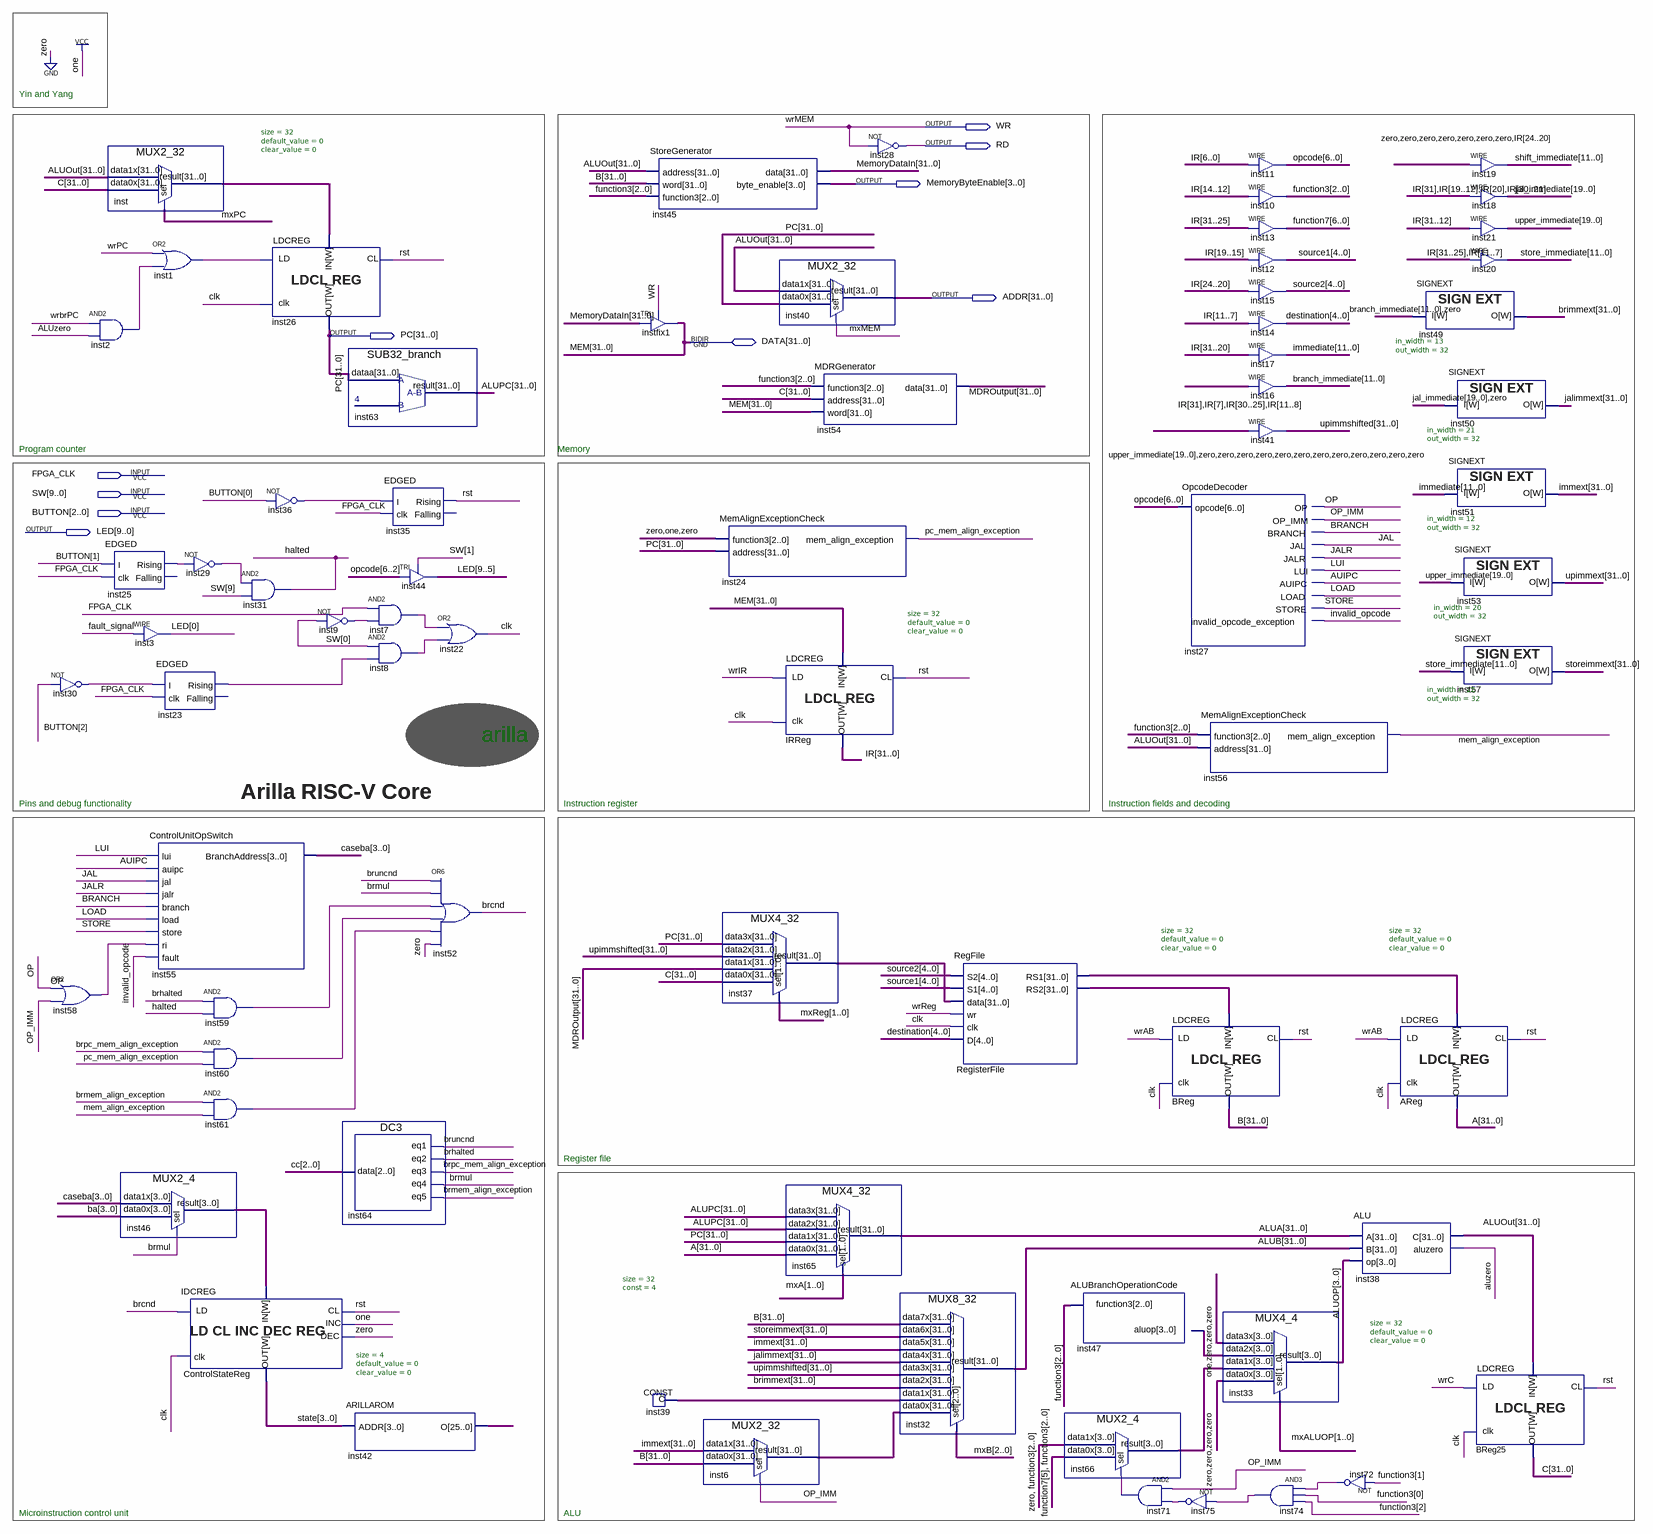
[diagram p0: schematic sheet]
// Quartus schematic ArillaCore.bdf as structural Verilog: 72 symbols, 10 pins
module ArillaCore (
  input  FPGA_CLK,
  input  [9:0] SW,
  input  [2:0] BUTTON,
  inout  [31:0] DATA,
  output WR,
  output RD,
  output [3:0] MemoryByteEnable,
  output [31:0] ADDR,
  output [31:0] PC,
  output [9:0] LED
);

  wire ALUzero, AUIPC, BRANCH, brcnd, brhalted, brmem_align_exception, brmul, brpc_mem_align_exception,
       bruncnd, clk, fault_signal, halted, inst1_out, inst2_out, inst7_out, inst8_out, inst9_out,
       inst23_rising, inst25_rising, inst29_out, inst30_out, inst36_out, inst58_out, inst59_out, inst60_out,
       inst61_out, inst71_out, inst72_out, inst74_out, inst75_out, invalid_opcode, JAL, JALR, LOAD, LUI,
       mem_align_exception, mxMEM, mxPC, OP, OP_IMM, pc_mem_align_exception, rst, STORE, wrAB, wrbrPC, wrC,
       wrIR, wrPC, wrReg;
  wire [1:0] mxA, mxALUOP, mxReg;
  wire [2:0] cc, function3, mxB;
  wire [3:0] ALUOP, ba, caseba, inst46_result, inst47_aluop, inst66_result, state;
  wire [4:0] destination, source1, source2;
  wire [6:0] function7, opcode;
  wire [11:0] branch_immediate, immediate, shift_immediate, store_immediate;
  wire [19:0] jal_immediate, upper_immediate;
  wire [31:0] A, ALUA, ALUB, ALUOut, ALUPC, B, brimmext, C, immext, inst6_result, inst37_result, inst39_data,
       inst_result, IR, jalimmext, MDROutput, MemoryDataIn, RegisterFile_rs1, RegisterFile_rs2, storeimmext,
       upimmext, upimmshifted;

  and inst2 (inst2_out, wrbrPC, ALUzero);
  not inst30 (inst30_out, BUTTON[2]);
  or inst58 (inst58_out, OP, OP_IMM);
  MUX2_32 inst (.data1x(ALUOut), .data0x(C), .sel(mxPC), .result(inst_result));
  EDGED inst25 (.I(BUTTON[1]), .clk(FPGA_CLK), .Rising(inst25_rising));  // open: Falling
  assign LED[0] = fault_signal;  // WIRE inst3
  ControlUnitOpSwitch inst55 (
    .lui(LUI), .auipc(AUIPC), .jal(JAL), .jalr(JALR), .branch(BRANCH), .load(LOAD), .store(STORE),
    .ri(inst58_out), .fault(invalid_opcode), .BranchAddress(caseba));
  MUX2_4 inst46 (.data1x(caseba), .data0x(ba), .sel(brmul), .result(inst46_result));
  or inst1 (inst1_out, wrPC, inst2_out);
  not inst29 (inst29_out, inst25_rising);
  EDGED inst23 (.I(inst30_out), .clk(FPGA_CLK), .Rising(inst23_rising));  // open: Falling
  IDCREG #(.size(4), .default_value(0), .clear_value(0)) ControlStateReg (
    .clk(clk), .data_in(inst46_result), .cl(rst), .inc(1'b1), .dec(1'b0), .ld(brcnd), .data_out(state));
  and inst31 (halted, inst29_out, SW[9]);
  and inst59 (inst59_out, brhalted, halted);
  and inst60 (inst60_out, brpc_mem_align_exception, pc_mem_align_exception);
  and inst61 (inst61_out, brmem_align_exception, mem_align_exception);
  LDCREG #(.size(32), .default_value(0), .clear_value(0)) inst26 (
    .clk(clk), .data_in(inst_result), .cl(rst), .ld(inst1_out), .data_out(PC));
  not inst36 (inst36_out, BUTTON[0]);
  SUB32_branch inst63 (.dataa(PC), .result(ALUPC));
  not inst9 (inst9_out, SW[0]);
  DC3 inst64 (
    .data(cc), .eq1(bruncnd), .eq2(brhalted), .eq3(brpc_mem_align_exception), .eq4(brmul),
    .eq5(brmem_align_exception));
  ARILLAROM inst42 (
    .ADDR(state),
    .O({ba, cc, fault_signal, mxALUOP[0], WR, mxMEM, mxALUOP[1], wrbrPC, mxB[2], mxReg[0], wrReg, mxReg[1], wrC, mxA[1], mxB[1], wrAB, mxB[0], mxA[0], wrPC, mxPC, wrIR}));
  EDGED inst35 (.I(inst36_out), .clk(FPGA_CLK), .Rising(rst));  // open: Falling
  TRI inst44[4:0] (.IN(opcode[6:2]), .OE(SW[1]), .OUT(LED[9:5]));
  and inst7 (inst7_out, FPGA_CLK, inst9_out);
  and inst8 (inst8_out, SW[0], inst23_rising);
  or inst22 (clk, inst7_out, inst8_out);
  or inst52 (brcnd, bruncnd, brmul, inst59_out, inst60_out, inst61_out, 1'b0);
  StoreGenerator inst45 (
    .address(ALUOut), .word(B), .function3(function3), .data(MemoryDataIn), .byte_enable(MemoryByteEnable));
  TRI instfix1[31:0] (.IN(MemoryDataIn), .OE(WR), .OUT(DATA));
  CONST #(.size(32), .\const (4)) inst39 (.data(inst39_data));
  MUX2_32 inst6 (.data1x(immext), .data0x(B), .sel(OP_IMM), .result(inst6_result));
  MemAlignExceptionCheck inst24 (.function3(3'b010), .address(PC), .mem_align_exception(pc_mem_align_exception));
  MUX4_32 inst37 (
    .data3x(PC), .data2x(upimmshifted), .data1x(MDROutput), .data0x(C), .sel(mxReg), .result(inst37_result));
  MUX2_32 inst40 (.data1x(ALUOut), .data0x(PC), .sel(mxMEM), .result(ADDR));
  LDCREG #(.size(32), .default_value(0), .clear_value(0)) IRReg (
    .clk(clk), .data_in(DATA), .cl(rst), .ld(wrIR), .data_out(IR));
  MUX4_32 inst65 (.data3x(ALUPC), .data2x(ALUPC), .data1x(PC), .data0x(A), .sel(mxA), .result(ALUA));
  MDRGenerator inst54 (.function3(function3), .address(C), .word(DATA), .data(MDROutput));
  not inst28 (RD, WR);
  MUX8_32 inst32 (
    .data7x(B), .data6x(storeimmext), .data5x(immext), .data4x(jalimmext), .data3x(upimmshifted),
    .data2x(brimmext), .data1x(inst39_data), .data0x(inst6_result), .sel(mxB), .result(ALUB));
  RegFile RegisterFile (
    .S2(source2), .S1(source1), .data(inst37_result), .wr(wrReg), .clk(clk), .D(destination),
    .RS1(RegisterFile_rs1), .RS2(RegisterFile_rs2));
  ALUBranchOperationCode inst47 (.function3(function3), .aluop(inst47_aluop));
  MUX2_4 inst66 (
    .data1x({1'b0, function3}), .data0x({function7[5], function3}), .sel(inst71_out), .result(inst66_result));
  LDCREG #(.size(32), .default_value(0), .clear_value(0)) BReg (
    .clk(clk), .data_in(RegisterFile_rs2), .cl(rst), .ld(wrAB), .data_out(B));
  and inst71 (inst71_out, OP_IMM, inst75_out);
  OpcodeDecoder inst27 (
    .opcode(opcode), .OP(OP), .OP_IMM(OP_IMM), .BRANCH(BRANCH), .JAL(JAL), .JALR(JALR), .LUI(LUI),
    .AUIPC(AUIPC), .LOAD(LOAD), .STORE(STORE), .invalid_opcode_exception(invalid_opcode));
  MemAlignExceptionCheck inst56 (.function3(function3), .address(ALUOut), .mem_align_exception(mem_align_exception));
  not inst75 (inst75_out, inst74_out);
  assign opcode = IR[6:0];  // WIRE inst11
  assign function3 = IR[14:12];  // WIRE inst10
  assign function7 = IR[31:25];  // WIRE inst13
  assign source1 = IR[19:15];  // WIRE inst12
  assign source2 = IR[24:20];  // WIRE inst15
  assign destination = IR[11:7];  // WIRE inst14
  assign immediate = IR[31:20];  // WIRE inst17
  assign branch_immediate = {IR[31], IR[7], IR[30:25], IR[11:8]};  // WIRE inst16
  assign upimmshifted = {upper_immediate, {12{1'b0}}};  // WIRE inst41
  MUX4_4 inst33 (
    .data3x(4'b1000), .data2x(inst47_aluop), .data1x(inst66_result), .data0x(4'b0000), .sel(mxALUOP),
    .result(ALUOP));
  and inst74 (inst74_out, inst72_out, function3[0], function3[2]);
  ALU inst38 (.A(ALUA), .B(ALUB), .op(ALUOP), .C(ALUOut), .aluzero(ALUzero));
  not inst72 (inst72_out, function3[1]);
  SIGNEXT #(.in_width(13), .out_width(32)) inst49 (.I({branch_immediate, 1'b0}), .O(brimmext));
  LDCREG #(.size(32), .default_value(0), .clear_value(0)) AReg (
    .clk(clk), .data_in(RegisterFile_rs1), .cl(rst), .ld(wrAB), .data_out(A));
  SIGNEXT #(.in_width(21), .out_width(32)) inst50 (.I({jal_immediate, 1'b0}), .O(jalimmext));
  SIGNEXT #(.in_width(12), .out_width(32)) inst51 (.I(immediate), .O(immext));
  SIGNEXT #(.in_width(20), .out_width(32)) inst53 (.I(upper_immediate), .O(upimmext));
  SIGNEXT #(.in_width(12), .out_width(32)) inst57 (.I(store_immediate), .O(storeimmext));
  LDCREG #(.size(32), .default_value(0), .clear_value(0)) BReg25 (
    .clk(clk), .data_in(ALUOut), .cl(rst), .ld(wrC), .data_out(C));
  assign shift_immediate = {{7{1'b0}}, IR[24:20]};  // WIRE inst19
  assign jal_immediate = {IR[31], IR[19:12], IR[20], IR[30:21]};  // WIRE inst18
  assign upper_immediate = IR[31:12];  // WIRE inst21
  assign store_immediate = {IR[31:25], IR[11:7]};  // WIRE inst20

  // Other names for the same wires on the sheet: MEM[31:0] = DATA; wrMEM = WR

  // Notes on the sheet:
  //   Yin and Yang
  //   Program counter
  //   Memory
  //   arilla
  //   Arilla RISC-V Core  
  //   Pins and debug functionality
  //   Instruction register
  //   Instruction fields and decoding
  //   Register file
  //   Microinstruction control unit
  //   ALU
endmodule
